# Altium schematic sheet rpi_shield.SchDoc: Tool Armoury Slave
size A4; DrawnBy: Luke Hovington; Organization: HSBNE; DocumentNumber: 1; Revision: 2; SheetNumber: 1; SheetTotal: 1; ProjectName: Tool Armoury Slave
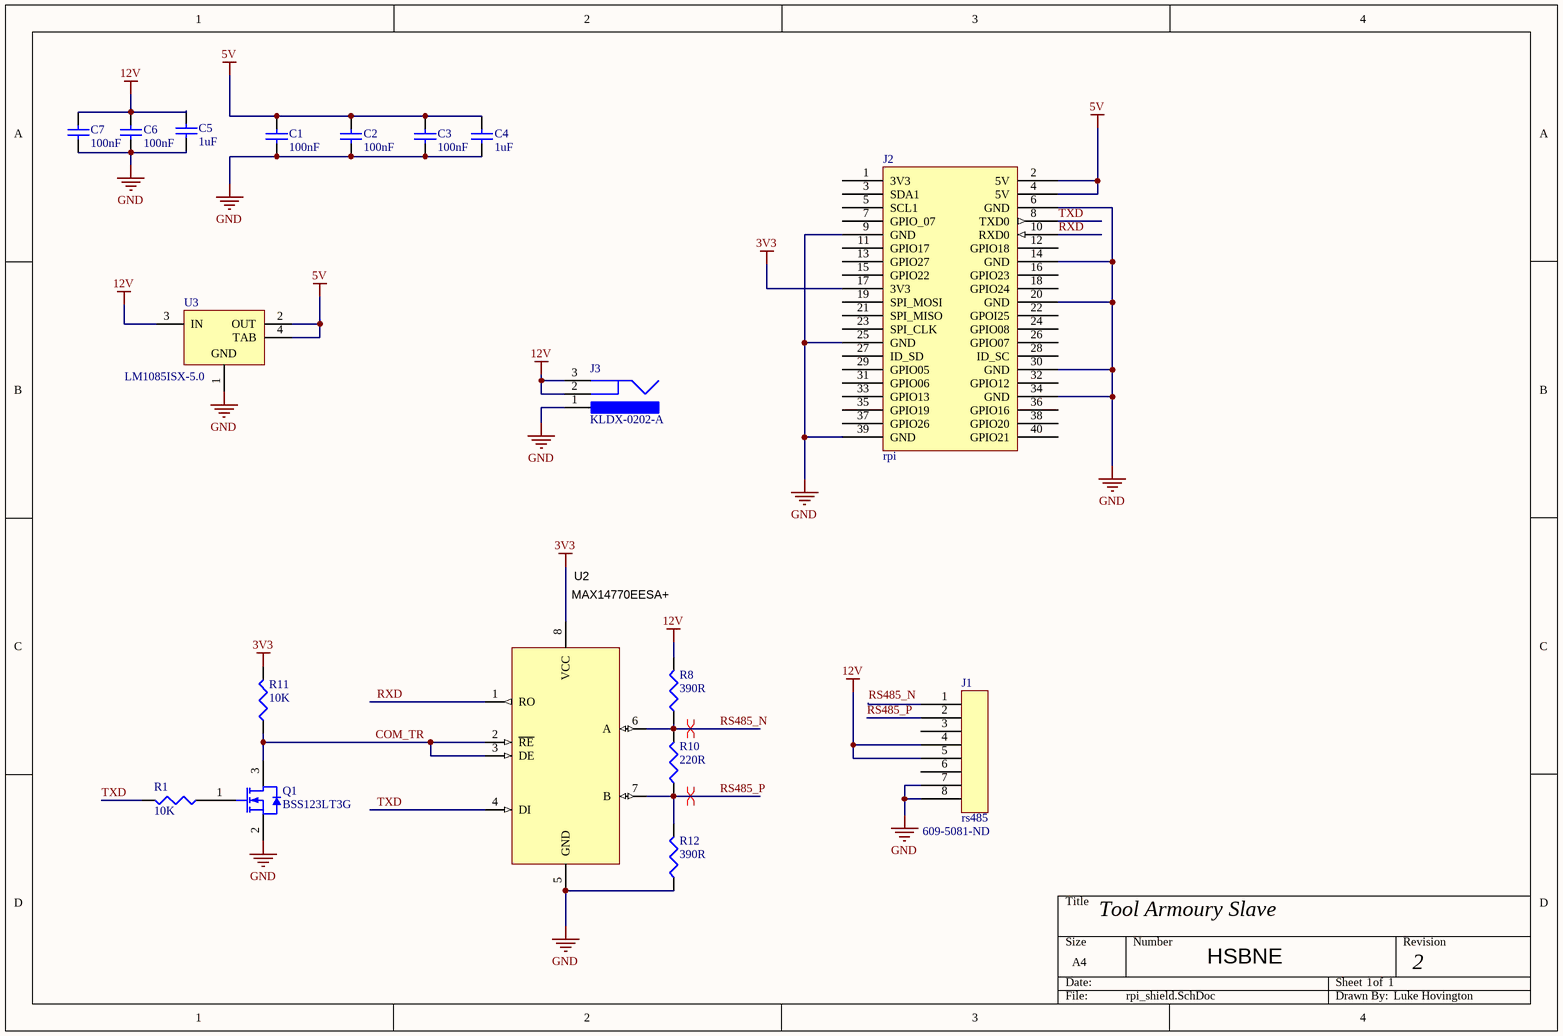
[diagram p0: rpi_shield.SchDoc]

## Parts
C1  100nF  [C1206]
C2  100nF  [C1206]
C3  100nF  [C1206]
C4  1uF  [C1206]
C5  1uF  [C1206]
C6  100nF  [C1206]
C7  100nF  [C1206]
J1  rs485  Supplier Part Number 1: 609-5081-ND  [RJ45]
J2  rpi  [2x20]
J3  KLDX-0202-A  [KYCN-KLDX-0202-A_V]
Q1  BSS123LT3G  [ONSC-SOT-23-3-318-08_V]
R1  10K  [C1206]
R8  390R  [C1206]
R10  220R  [C1206]
R11  10K  [C1206]
R12  390R  [C1206]
U2  MAX14770EESA+  [8S1_L]
U3  LM1085ISX-5.0  [TS3B_L]

## Nets
3V3: J2.17(3V3) R11.2 U2.8(VCC)
5V: C1.2 C2.2 C3.2 C4.2 J2.2(5V) J2.4(5V) U3.2(OUT) U3.4(TAB)
12V: C5.2 C6.2 C7.2 J1.4 J1.5 J3.2 J3.3 R8.2 U3.3(IN)
GND: C1.1 C2.1 C3.1 C4.1 C5.1 C6.1 C7.1 J1.7 J1.8 J2.6(GND) J2.9(GND) J2.14(GND) J2.20(GND) J2.25(GND) J2.30(GND) J2.34(GND) J2.39(GND) J3.1 Q1.2(S) R12.1 U2.5(GND) U3.1(GND)
COM_TR: Q1.3(D) R11.1 U2.2(~{RE}) U2.3(DE)
RS485_N: J1.1 R8.1 R10.2 U2.6(A)
RS485_P: J1.2 R10.1 R12.2 U2.7(B)
RXD: J2.10(RXD0) U2.1(RO)
TXD: J2.8(TXD0) R1.2 U2.4(DI)
NetQ1_1: Q1.1(G) R1.1

Not connected (* = marked no-connect by the designer): J1 3 6; J2 1(3V3) 3(SDA1) 5(SCL1) 7(GPIO_07) 11(GPIO17) 12(GPIO18) 13(GPIO27) 15(GPIO22) 16(GPIO23) 18(GPIO24) 19(SPI_MOSI) 21(SPI_MISO) 22(GPOI25) 23(SPI_CLK) 24(GPIO08) 26(GPIO07) 27(ID_SD) 28(ID_SC) 29(GPIO05) 31(GPIO06) 32(GPIO12) 33(GPIO13) 35(GPIO19) 36(GPIO16) 37(GPIO26) 38(GPIO20) 40(GPIO21)

## Layout directives
differential pair: RS485_N, RS485_P

## Library data of the parts
C1-C3 C6 C7 = Cap 100nF: Capacitor (Semiconductor SIM Model); Published: 8-Jun-2000; LatestRevisionDate: 29-May-2009; LatestRevisionNote: IPC-7351 Footprint Added.; PackageReference: C1206; Publisher: Altium Limited; PackageDescription: Chip Capacitor; Value: 100nF; Supplier 1: Digi-Key; Supplier 2: Mouser; Supplier Part Number 1: 399-1249-1-ND; Supplier Part Number 2: 80-C1206C104K5R
C4 C5 = Cap 1uF: Capacitor (Semiconductor SIM Model); Published: 8-Jun-2000; LatestRevisionDate: 29-May-2009; LatestRevisionNote: IPC-7351 Footprint Added.; PackageReference: C1206; Publisher: Altium Limited; PackageDescription: Chip Capacitor; Value: 1uF; Supplier 1: Mouser; Supplier 2: Digi-Key; Supplier Part Number 1: 80-C1206C105K5R; Supplier Part Number 2: 399-8150-1-ND
J1 = rj45: Supplier 1: Digi-Key
J2 = rpi2: RaspPi I/O header
J3 = CMP-1673-00001-5: DC Power Jack, 24 V, 3.5 A, -25 to 85 degC, 3-Pin THD, RoHS; Manufacturer: Kycon; Voltage Rating: 24 V; Current Rating: 3.5 A; Height: 10.8 mm; Length: 9.2 mm; Pins: 2; Housing Material: PBT; Connector Type: Power; ComponentLink2URL: http://www.kycon.com/Pub_Eng_Draw/KLDX-0202-X.PDF; PackageDescription: 3-Pin Through Hole Device, Body 14.5 x 9 mm; Max Operating Temperature: 85 degC; Min Operating Temperature: -25 degC; PackageReference: KLDX-0202-A; Contact Gender: Female; Package Quantity: 500; Mount: Through Hole; Colour: Black; Contact Plating: Tin; DatasheetVersion: Rev. D3, 06/2013; ComponentLink2Description: Datasheet; RoHSCompliant: true; Mounting Technology: Through Hole; ComponentLink1Description: Manufacturer URL; Contact Material: Brass; ComponentLink1URL: http://www.kycon.com/
Q1 = CMP-1058-00787-1: Power MOSFET, 170 mA, 100 V, N-Channel, 3-Pin SOT-23, Pb-Free, Tape and Reel; Manufacturer: On Semiconductor; PD Max (W): 0.225; VGS Max (V): 20; Coss Typ (pF): 9; ID Max (A): 0.17; Crss Typ (pF): 4; VGS(th) Max (V): 2.6; V(BR)DSS Min (V): 100; Configuration: Single; Channel Polarity: N Channel; ComponentLink1Description: Manufacturer URL; Mounting Technology: Surface Mount; ComponentLink3URL: http://www.onsemi.cn/pub_link/Collateral/318-08.PDF; RoHS: Pb-Free; Packing: Tape and Reel; ComponentLink2Description: Datasheet; PartNumber: BSS123LT3G; DatasheetVersion: Rev. 8; PackageReference: SOT-23-3-318-08; ComponentLink3Description: Package Specification; PackageVersion: Rev. AP, 11/2009; ComponentLink2URL: http://www.onsemi.com/pub_link/Collateral/BSS123LT1-D.PDF; ComponentLink1URL: http://www.onsemi.com/; Ciss Typ (pF): 20; Package Type: SOT-23-3; PackageDescription: 3-Pin Small Outline Transistor, Body 2.92 x 1.3 mm, Pitch 0.95 mm
R1 R11 = Resistor-10K: Published: 8-Jun-2000; LatestRevisionDate: 29-May-2009; LatestRevisionNote: IPC-7351 Footprint Added.; PackageReference: J1-0603; Publisher: Altium Limited; PackageDescription: Chip Resistor; Value: 10K; Supplier 1: Digi-Key; Supplier 2: Mouser; Supplier Part Number 1: P10KECT-ND; Supplier Part Number 2: 71-CRCW1206-10K-E3
R8 R12 = Resistor-390R: Published: 8-Jun-2000; LatestRevisionDate: 29-May-2009; LatestRevisionNote: IPC-7351 Footprint Added.; PackageReference: J1-0603; Publisher: Altium Limited; PackageDescription: Chip Resistor; Value: 390R; Supplier 1: Digi-Key; Supplier Part Number 1: RMCF1206JT390RCT-ND
R10 = Resistor-220R: Published: 8-Jun-2000; LatestRevisionDate: 29-May-2009; LatestRevisionNote: IPC-7351 Footprint Added.; PackageReference: J1-0603; Publisher: Altium Limited; PackageDescription: Chip Resistor; Value: 220R; Supplier 1: Digi-Key; Supplier Part Number 1: RMCF1206JT220RCT-ND
U2 = MAX14770EESA+: TXRX PROFIBUS RS-485 8-SOIC; MPN: MAX14770EESA+; Supplier 1: Mouser; Supplier 2: Digi-Key; Supplier Part Number 1: 700-MAX14770EESA+; Supplier Part Number 2: MAX14770EESA+-ND
U3 = CMP-0062-00621-3: 3A Low Dropout Positive Regulators, 3-pin TO-263; Manufacturer: National Semiconductor; PackageTopMarking: NSUZXYTTE#*LM1085*IS-5.0; High-Reliability: Y; PowerWise: N; CompType: LDO IC; PartNumber: LM1085ISX-5.0; ComponentLink2URL: http://www.national.com/ds/LM/LM1085.pdf; ComponentLink2Description: LM1085 Datasheet; RevisionNote: SCH symbol layout adjusted; PinCount: 3; ComponentLink3Description: LM1085 Web Page; PackageVersion: revF, Apr-2005; ComponentLink3URL: http://www.national.com/pf/LM/LM1085.html; PackageDescription: TO-263, Molded, .400 x .390 x .180in, 3 Lead, .1in Pitch, Surface Mount; Code_JEDEC: MO-169-AA; PackageReference: TS3B; ComponentLink1URL: http://www.national.com/; RoHS: N; DatasheetVersion: Jun-2005; ComponentLink4URL: http://www.national.com/packaging/folders/ts3b.html; ComponentLink4Description: TS3B Package Page; ComponentLink1Description: Manufacturer URL